# Altium schematic sheet 1 - Top.SchDoc
size A3; PageSetup: Record=PageOptions|CenterHorizontal=True|CenterVertical=True|PrintScale=0.71|XCorrection=1.00|YCorrection=1.00|PrintKind=0|BorderSize=5000000|LeftOffset=0|BottomOffset=0|Orientation=2|PaperLength=2970|PaperWidth=2100|Scale=100|PaperSource=7|PrintQuality=-4|MediaType=1|DitherType=10|PaperKind=A4 (210 x 297 mm)|PrintScaleMode=1
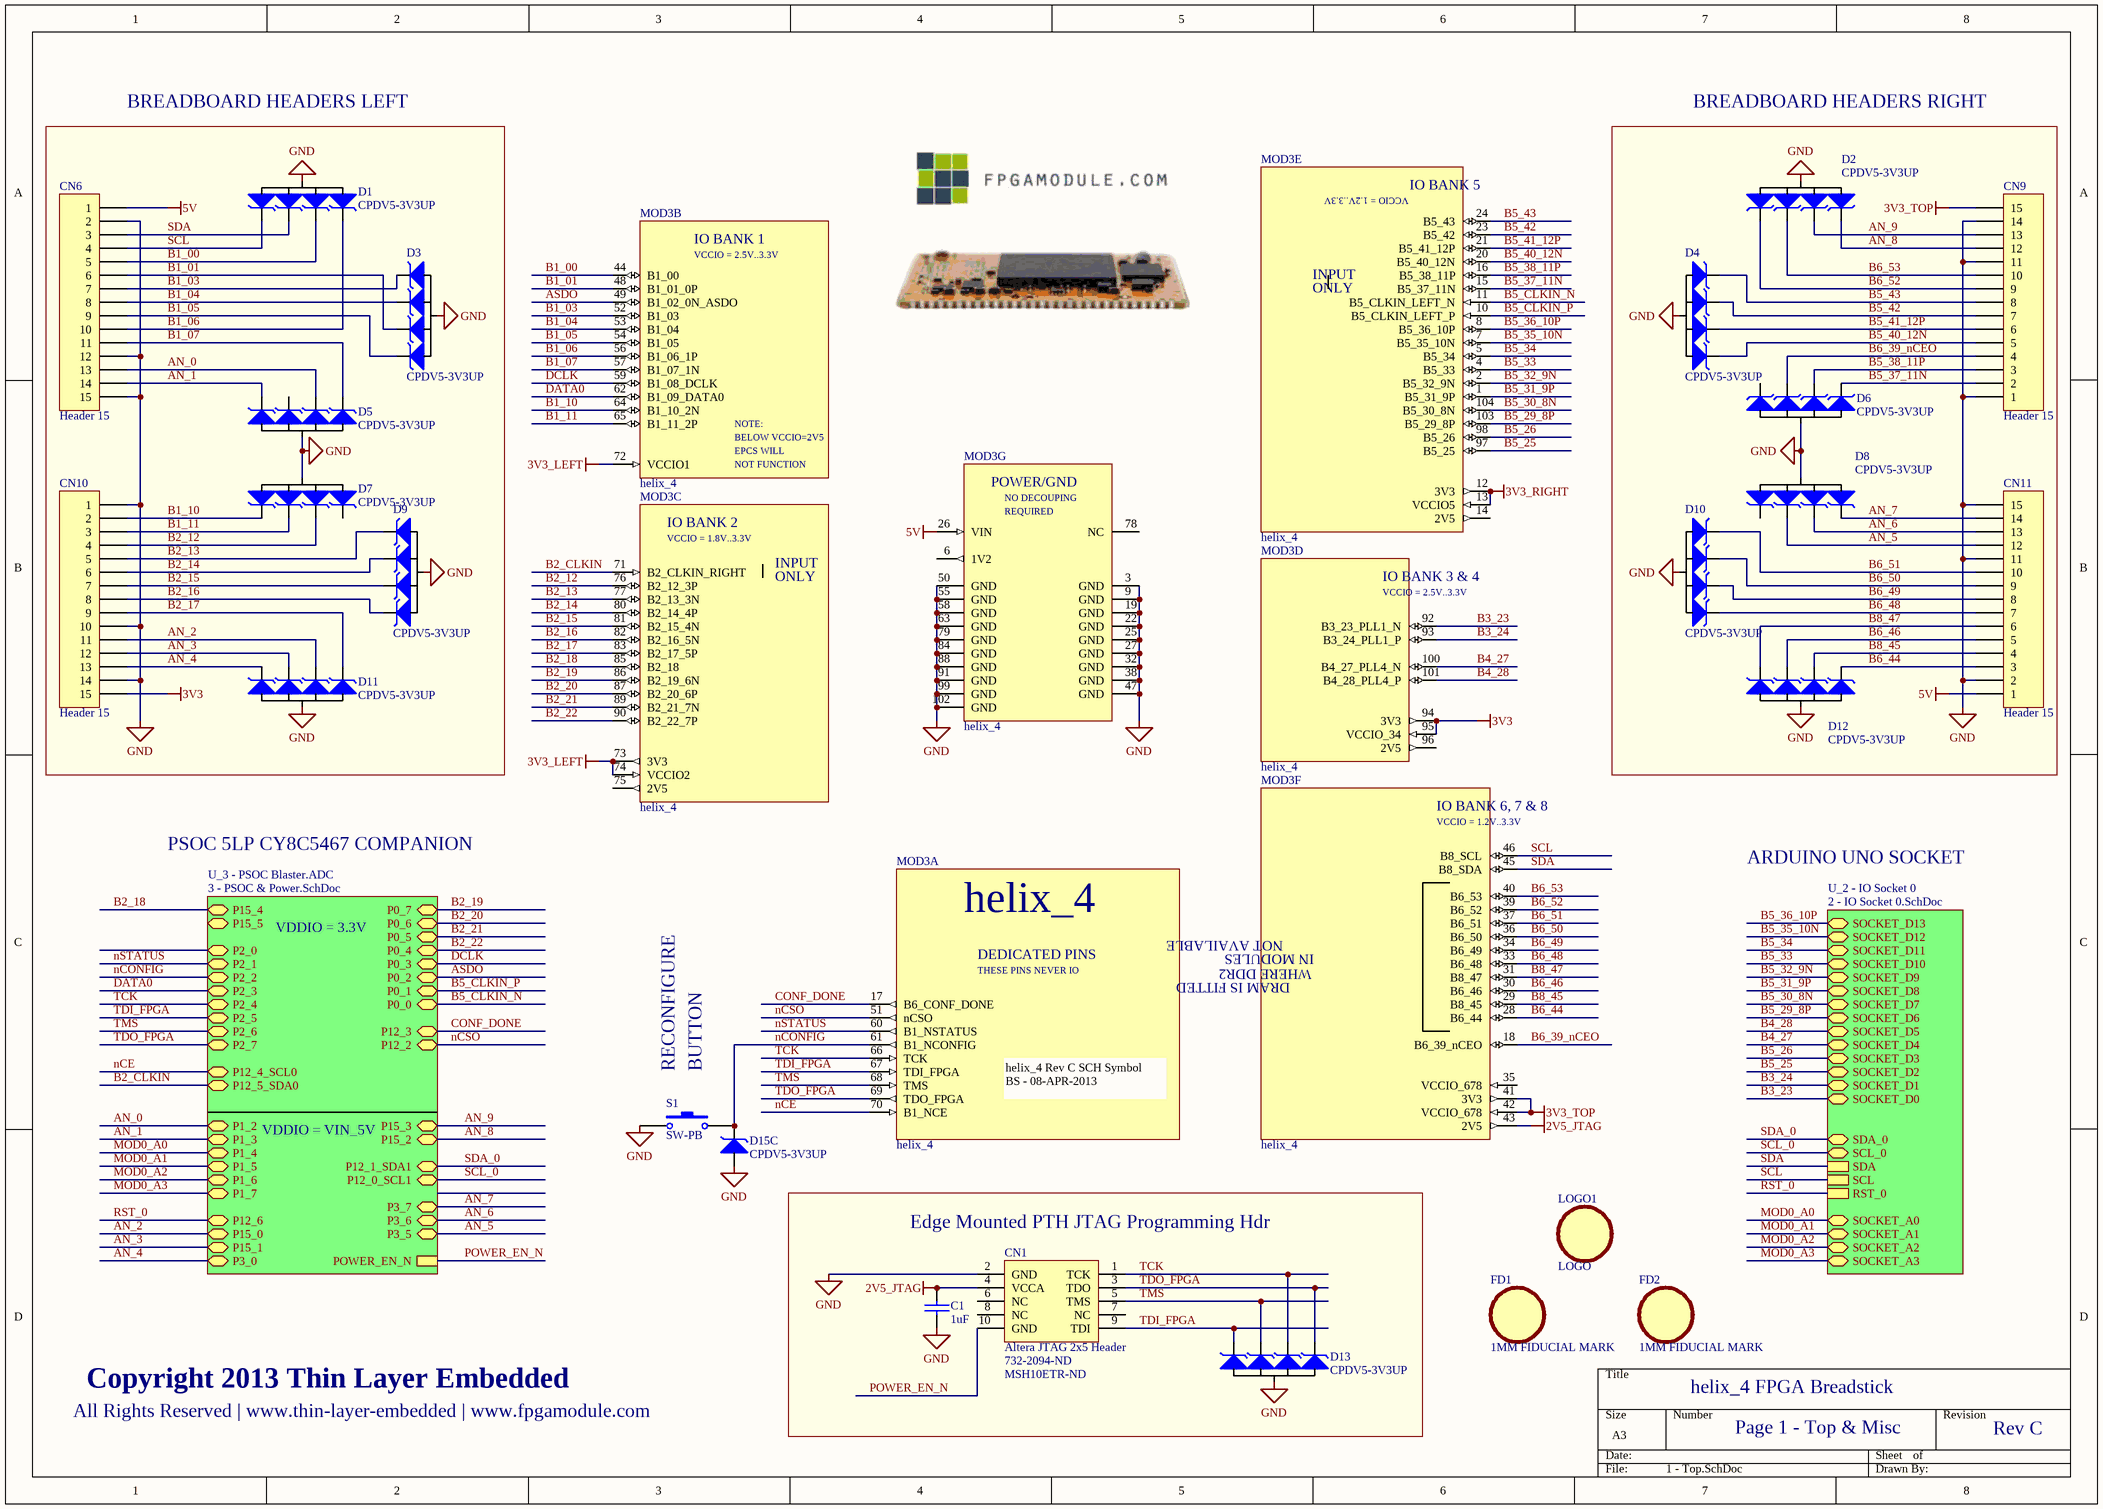
[diagram p0: 1 - Top.SchDoc]

## Parts
C1  1uF  [0805]
CN1  Altera JTAG 2x5 Header  Supplier Part Number 1: 732-2094-ND  Supplier Part Number 2: MSH10ETR-ND  [BOXHDR2X5_EDGE]
CN6  Header 15  [HDR1X15]
CN9  Header 15  [HDR1X15]
CN10  Header 15  [HDR1X15]
CN11  Header 15  [HDR1X15]
D1  CPDV5-3V3UP  [SOT-353]
D2  CPDV5-3V3UP  [SOT-353]
D3  CPDV5-3V3UP  [SOT-353]
D4  CPDV5-3V3UP  [SOT-353]
D5  CPDV5-3V3UP  [SOT-353]
D6  CPDV5-3V3UP  [SOT-353]
D7  CPDV5-3V3UP  [SOT-353]
D8  CPDV5-3V3UP  [SOT-353]
D9  CPDV5-3V3UP  [SOT-353]
D10  CPDV5-3V3UP  [SOT-353]
D11  CPDV5-3V3UP  [SOT-353]
D12  CPDV5-3V3UP  [SOT-353]
D13  CPDV5-3V3UP  [SOT-353]
D15  CPDV5-3V3UP  [sot-353]  (part C of 4)
FD1  1MM FIDUCIAL MARK  [FID_1MM]
FD2  1MM FIDUCIAL MARK  [FID_1MM]
LOGO1  LOGO  [LOGO_SMALL - SILK]
MOD3  helix_4  [HELIX_4_LCC104_HOST]  (parts A,B,C,D,E,F,G of 7)
S1  SW-PB  [FSM4JSMA]

## Blocks framed on the sheet
BREADBOARD HEADERS LEFT: CN6 CN10 D1 D3 D5 D7 D9 D11
BREADBOARD HEADERS RIGHT: CN9 CN11 D2 D4 D6 D8 D10 D12
Edge Mounted PTH JTAG Programming Hdr: C1 CN1 D13

## Sub-sheets
U_2 - IO Socket 0 = 2 - IO Socket 0.SchDoc: SCL, SDA, SDA_0, SCL_0, SOCKET_A0, SOCKET_A1, SOCKET_A2, SOCKET_A3, SOCKET_D0, SOCKET_D1, SOCKET_D2, SOCKET_D3, SOCKET_D4, SOCKET_D5, SOCKET_D6, SOCKET_D7, SOCKET_D8, SOCKET_D9, SOCKET_D10, SOCKET_D11, SOCKET_D12, SOCKET_D13, RST_0
U_3 - PSOC Blaster.ADC = 3 - PSOC & Power.SchDoc: P15_4, P15_5, P12_6, P2_0, P1_5, P1_6, P1_7, P2_1, P2_2, P2_3, P2_4, P2_5, P2_6, P2_7, P12_3, P12_2, POWER_EN_N, P0_0, P1_4, P1_3, P12_4_SCL0, P12_5_SDA0, P12_1_SDA1, P12_0_SCL1, P1_2, P0_1, P0_2, P0_3, P0_4, P0_5, P0_6, P0_7, P3_5, P3_6, P3_7, P15_0, P15_2, P15_3, P15_1, P3_0

## Nets
2V5_JTAG: C1.2 CN1.4(VCCA) MOD3.43(2V5)
3V3: CN10.15 MOD3.94(3V3) MOD3.95(VCCIO_34)
3V3_LEFT: MOD3.72(VCCIO1) MOD3.73(3V3) MOD3.74(VCCIO2)
3V3_RIGHT: MOD3.12(3V3) MOD3.13(VCCIO5)
3V3_TOP: CN9.15 MOD3.41(3V3) MOD3.42(VCCIO_678)
5V: CN6.1 CN11.1 MOD3.26(VIN)
GND: C1.1 CN1.2(GND) CN6.2 CN6.12 CN6.15 CN9.1 CN9.11 CN9.14 CN10.1 CN10.10 CN10.14 CN11.2 CN11.11 CN11.15 D1.2(A) D2.2(A) D3.2(A) D4.2(A) D5.2(A) D6.2(A) D7.2(A) D8.2(A) D9.2(A) D10.2(A) D11.2(A) D12.2(A) D13.2(A) D15.2(A) MOD3.3(GND) MOD3.9(GND) MOD3.19(GND) MOD3.22(GND) MOD3.25(GND) MOD3.27(GND) MOD3.32(GND) MOD3.38(GND) MOD3.47(GND) MOD3.50(GND) MOD3.55(GND) MOD3.58(GND) MOD3.63(GND) MOD3.79(GND) MOD3.84(GND) MOD3.88(GND) MOD3.91(GND) MOD3.99(GND) MOD3.102(GND) S1.1
AN_0: CN6.13 D5.5(K1) ; sheet U_3 - PSOC Blaster.ADC/P1_2
AN_1: CN6.14 D5.3(K1) ; sheet U_3 - PSOC Blaster.ADC/P1_3
AN_2: CN10.11 D11.5(K1) ; sheet U_3 - PSOC Blaster.ADC/P15_0
AN_3: CN10.12 D11.1(K2) ; sheet U_3 - PSOC Blaster.ADC/P15_1
AN_4: CN10.13 D11.3(K1) ; sheet U_3 - PSOC Blaster.ADC/P3_0
AN_5: CN11.12 D8.5(K1) ; sheet U_3 - PSOC Blaster.ADC/P3_5
AN_6: CN11.13 D8.1(K2) ; sheet U_3 - PSOC Blaster.ADC/P3_6
AN_7: CN11.14 D8.3(K1) ; sheet U_3 - PSOC Blaster.ADC/P3_7
AN_8: CN9.12 D2.4(K2) ; sheet U_3 - PSOC Blaster.ADC/P15_2
AN_9: CN9.13 D2.5(K1) ; sheet U_3 - PSOC Blaster.ADC/P15_3
ASDO: MOD3.49(B1_02_0N_ASDO) ; sheet U_3 - PSOC Blaster.ADC/P0_2
B1_00: CN6.5 D1.1(K2) MOD3.44(B1_00)
B1_01: CN6.6 D3.5(K1) MOD3.48(B1_01_0P)
B1_03: CN6.7 D3.3(K1) MOD3.52(B1_03)
B1_04: CN6.8 D3.1(K2) MOD3.53(B1_04)
B1_05: CN6.9 D3.4(K2) MOD3.54(B1_05)
B1_06: CN6.10 D1.3(K1) MOD3.56(B1_06_1P)
B1_07: CN6.11 D5.4(K2) MOD3.57(B1_07_1N)
B1_10: CN10.2 D7.4(K2) MOD3.64(B1_10_2N)
B1_11: CN10.3 D7.5(K1) MOD3.65(B1_11_2P)
B2_12: CN10.4 D7.1(K2) MOD3.76(B2_12_3P)
B2_13: CN10.5 D9.4(K2) MOD3.77(B2_13_3N)
B2_14: CN10.6 D9.5(K1) MOD3.80(B2_14_4P)
B2_15: CN10.7 D9.1(K2) MOD3.81(B2_15_4N)
B2_16: CN10.8 D9.3(K1) MOD3.82(B2_16_5N)
B2_17: CN10.9 D11.4(K2) MOD3.83(B2_17_5P)
B2_18: MOD3.85(B2_18) ; sheet U_3 - PSOC Blaster.ADC/P15_4
B2_19: MOD3.86(B2_19_6N) ; sheet U_3 - PSOC Blaster.ADC/P0_7
B2_20: MOD3.87(B2_20_6P) ; sheet U_3 - PSOC Blaster.ADC/P0_6
B2_21: MOD3.89(B2_21_7N) ; sheet U_3 - PSOC Blaster.ADC/P0_5
B2_22: MOD3.90(B2_22_7P) ; sheet U_3 - PSOC Blaster.ADC/P0_4
B2_CLKIN: MOD3.71(B2_CLKIN_RIGHT) ; sheet U_3 - PSOC Blaster.ADC/P12_5_SDA0
B3_23: MOD3.92(B3_23_PLL1_N) ; sheet U_2 - IO Socket 0/SOCKET_D0
B3_24: MOD3.93(B3_24_PLL1_P) ; sheet U_2 - IO Socket 0/SOCKET_D1
B4_27: MOD3.100(B4_27_PLL4_N) ; sheet U_2 - IO Socket 0/SOCKET_D4
B4_28: MOD3.101(B4_28_PLL4_P) ; sheet U_2 - IO Socket 0/SOCKET_D5
B5_25: MOD3.97(B5_25) ; sheet U_2 - IO Socket 0/SOCKET_D2
B5_26: MOD3.98(B5_26) ; sheet U_2 - IO Socket 0/SOCKET_D3
B5_29_8P: MOD3.103(B5_29_8P) ; sheet U_2 - IO Socket 0/SOCKET_D6
B5_30_8N: MOD3.104(B5_30_8N) ; sheet U_2 - IO Socket 0/SOCKET_D7
B5_31_9P: MOD3.1(B5_31_9P) ; sheet U_2 - IO Socket 0/SOCKET_D8
B5_32_9N: MOD3.2(B5_32_9N) ; sheet U_2 - IO Socket 0/SOCKET_D9
B5_33: MOD3.4(B5_33) ; sheet U_2 - IO Socket 0/SOCKET_D10
B5_34: MOD3.5(B5_34) ; sheet U_2 - IO Socket 0/SOCKET_D11
B5_35_10N: MOD3.7(B5_35_10N) ; sheet U_2 - IO Socket 0/SOCKET_D12
B5_36_10P: MOD3.8(B5_36_10P) ; sheet U_2 - IO Socket 0/SOCKET_D13
B5_37_11N: CN9.2 D6.3(K1) MOD3.15(B5_37_11N)
B5_38_11P: CN9.3 D6.1(K2) MOD3.16(B5_38_11P)
B5_40_12N: CN9.5 D4.3(K1) MOD3.20(B5_40_12N)
B5_41_12P: CN9.6 D4.1(K2) MOD3.21(B5_41_12P)
B5_42: CN9.7 D4.5(K1) MOD3.23(B5_42)
B5_43: CN9.8 D4.4(K2) MOD3.24(B5_43)
B5_CLKIN_N: MOD3.11(B5_CLKIN_LEFT_N) ; sheet U_3 - PSOC Blaster.ADC/P0_0
B5_CLKIN_P: MOD3.10(B5_CLKIN_LEFT_P) ; sheet U_3 - PSOC Blaster.ADC/P0_1
B6_39_nCEO: CN9.4 D6.5(K1) MOD3.18(B6_39_nCEO)
B6_44: CN11.3 D12.4(K2) MOD3.28(B6_44)
B6_46: CN11.5 D12.1(K2) MOD3.30(B6_46)
B6_48: CN11.7 D10.4(K2) MOD3.33(B6_48)
B6_49: CN11.8 D10.5(K1) MOD3.34(B6_49)
B6_50: CN11.9 D10.1(K2) MOD3.36(B6_50)
B6_51: CN11.10 D10.3(K1) MOD3.37(B6_51)
B6_52: CN9.9 D2.3(K1) MOD3.39(B6_52)
B6_53: CN9.10 D2.1(K2) MOD3.40(B6_53)
B8_45: CN11.4 D12.5(K1) MOD3.29(B8_45)
B8_47: CN11.6 D12.3(K1) MOD3.31(B8_47)
CONF_DONE: MOD3.17(B6_CONF_DONE) ; sheet U_3 - PSOC Blaster.ADC/P12_3
DATA0: MOD3.62(B1_09_DATA0) ; sheet U_3 - PSOC Blaster.ADC/P2_3
DCLK: MOD3.59(B1_08_DCLK) ; sheet U_3 - PSOC Blaster.ADC/P0_3
MOD0_A0: sheet U_3 - PSOC Blaster.ADC/P1_4, sheet U_2 - IO Socket 0/SOCKET_A0
MOD0_A1: sheet U_3 - PSOC Blaster.ADC/P1_5, sheet U_2 - IO Socket 0/SOCKET_A1
MOD0_A2: sheet U_3 - PSOC Blaster.ADC/P1_6, sheet U_2 - IO Socket 0/SOCKET_A2
MOD0_A3: sheet U_3 - PSOC Blaster.ADC/P1_7, sheet U_2 - IO Socket 0/SOCKET_A3
nCE: MOD3.70(B1_NCE) ; sheet U_3 - PSOC Blaster.ADC/P12_4_SCL0
nCONFIG: D15.5(K3) MOD3.61(B1_NCONFIG) S1.2 ; sheet U_3 - PSOC Blaster.ADC/P2_2
nCSO: MOD3.51(nCSO) ; sheet U_3 - PSOC Blaster.ADC/P12_2
nSTATUS: MOD3.60(B1_NSTATUS) ; sheet U_3 - PSOC Blaster.ADC/P2_1
POWER_EN_N: CN1.10(GND) ; sheet U_3 - PSOC Blaster.ADC/POWER_EN_N
RST_0: sheet U_3 - PSOC Blaster.ADC/P12_6, sheet U_2 - IO Socket 0/RST_0
SCL: CN6.4 D1.4(K2) MOD3.46(B8_SCL) ; sheet U_2 - IO Socket 0/SCL
SCL_0: sheet U_3 - PSOC Blaster.ADC/P12_0_SCL1, sheet U_2 - IO Socket 0/SCL_0
SDA: CN6.3 D1.5(K1) MOD3.45(B8_SDA) ; sheet U_2 - IO Socket 0/SDA
SDA_0: sheet U_3 - PSOC Blaster.ADC/P12_1_SDA1, sheet U_2 - IO Socket 0/SDA_0
TCK: CN1.1(TCK) D13.5(K1) MOD3.66(TCK) ; sheet U_3 - PSOC Blaster.ADC/P2_4
TDI_FPGA: CN1.9(TDI) D13.3(K1) MOD3.67(TDI_FPGA) ; sheet U_3 - PSOC Blaster.ADC/P2_5
TDO_FPGA: CN1.3(TDO) D13.4(K2) MOD3.69(TDO_FPGA) ; sheet U_3 - PSOC Blaster.ADC/P2_7
TMS: CN1.5(TMS) D13.1(K2) MOD3.68(TMS) ; sheet U_3 - PSOC Blaster.ADC/P2_6

Not connected (* = marked no-connect by the designer): CN1 6(NC) 7(NC) 8(NC); D5 1(K2); D6 4(K2); D7 3(K1); D8 4(K2); FD1 1(FID); FD2 1(FID); LOGO1 1(FID); MOD3 6(1V2) 14(2V5) 35(VCCIO_678) 75(2V5) 78(NC) 96(2V5)

## Notes on the sheet
- PSOC 5LP CY8C5467 COMPANION
- ARDUINO UNO SOCKET
- VDDIO = 3.3V
- RECONFIGURE
- BUTTON
- VDDIO = VIN_5V
- Copyright 2013 Thin Layer Embedded
- helix_4 FPGA Breadstick
- All Rights Reserved | www.thin-layer-embedded | www.fpgamodule.com
- Page 1 - Top & Misc
- Rev C
- (in symbol helix_4 Rev C Module, part A) DEDICATED PINS; THESE PINS NEVER IO; helix_4 Rev C SCH Symbol / BS - 08-APR-2013 /
- (in symbol helix_4 Rev C Module, part B) IO BANK 1; VCCIO = 2.5V..3.3V; NOTE:; BELOW VCCIO=2V5; EPCS WILL; NOT FUNCTION
- (in symbol helix_4 Rev C Module, part C) IO BANK 2; VCCIO = 1.8V..3.3V; INPUT; ONLY
- (in symbol helix_4 Rev C Module, part D) IO BANK 3 & 4; VCCIO = 2.5V..3.3V
- (in symbol helix_4 Rev C Module, part E) IO BANK 5; VCCIO = 1.2V..3.3V; INPUT; ONLY
- (in symbol helix_4 Rev C Module, part F) IO BANK 6, 7 & 8; VCCIO = 1.2V..3.3V; NOT AVAILABLE; IN MODULES; WHERE DDR2; DRAM IS FITTED
- (in symbol helix_4 Rev C Module, part G) POWER/GND; NO DECOUPING; REQUIRED

## Library data of the parts
C1 = CAP: Capacitor
CN1 = Altera JTAG 2x5 Header: Header, 5-Pin, Dual row; Manufacturer: Wurth Electronics Inc; Manufacturer Part Number: 61201021621; Description: BOX HEADER 2.54MM MALE STR 10POS; Connector Type: Header, Shrouded; Number of Positions: 10; Number of Positions Loaded: All; Pitch: 0.100" (2.54mm); LatestRevisionDate: 17-Jul-2002; LatestRevisionNote: Re-released for DXP Platform.; Publisher: Altium Limited; Supplier 1: Digi-Key; RoHS: RoHS Compliant; Category: Connectors, Interconnects; Stock 1: 324; Pricing 1: 1=0.97, 25=0.8052, 100=0.713, 250=0.63252, 500=0.575, 1000=0.46, 2500=0.4025, 5000=0.3335, 10000=0.3059 (USD); Contact Type: Male Pin; Number of Rows: 2; Row Spacing: 0.100" (2.54mm); Contact Mating Length: -; Mounting Type: Through Hole; Termination: Solder; Fastening Type: -; Features: -; Contact Finish: Gold; Contact Finish Thickness: -; Color: Black; Packaging: Tray; ComponentLink1URL: http://www.we-online.de/eican/media/pdf/6120xx21621.pdf; ComponentLink1Description: http://www.we-online.de/eican/media/pdf/6120xx21621.pdf; Supplier 2: Digi-Key
CN6 CN9-CN11 = Header 15: Header, 15-Pin; LatestRevisionDate: 17-Jul-2002; LatestRevisionNote: Re-released for DXP Platform.; Publisher: Altium Limited
D1-D13 = 4CH ESD DIODE: 4CH ESD DIODE 3V3/3.5V
D15 = 4CH ESD DIODE (SPLIT): 4CH ESD DIODE 3V3/3.5V
FD1 FD2 LOGO1 = FID
MOD3 = helix_4 Rev C Module
S1 = SW-PB: Switch; Published: 24-Mar-1999; LatestRevisionDate: 17-Jul-2002; LatestRevisionNote: Re-released for DXP Platform.; PackageReference: SPST-2; Publisher: Altium Limited